# Altium schematic sheet RAK11720.SchDoc
size 420 x 297 mm; ENG_APP_DATE: --/--/--; DSN_APP_DATE: --/--/--; CHK_APP_DATE: --/--/--; Date: TEST; SheetNumber: 1; SheetTotal: 6; Sheet_Text_ProjectName: ApolloEcho_Dev_Kit; Sheet_Text_Author: mtnguyen; Sheet_Text_Title: RAK11720; Sheet_Text_Rev: 2.0.0; Sheet_Text_Date: Mar 01, 25; SPICEModelCacheMDNMBSZG: <root> / <DocumentId>MDNMBSZG</DocumentId> / <CacheFrame Number="0"> / <Model Name="emk105bj105_v-f" Kind="CKT"> / <Text>* EMK105BJ105_V-F     SPICE MODEL  ( General Type ) / *-------------------------------------------------------------------------------------------------------- / * Model Generated by TAIYO YUDEN Corporation (http://www.ty-top.com) / * Version 1.0 / * TAIYO YUDEN Control No. 170508_130520 / * Copyright(c) 2012 TAIYO YUDEN CO.,LTD. All Rights Reserved. / *-------------------------------------------------------------------------------------------------------- / * / * Products Name : Multilayer Ceramic Capacitors / * / * Characteristics : / *     Capacitance : 1 uF , Rated Voltage : 16V , TCC : X5R / *     Case Size : 1.0 x 0.5 / 0.039 x 0.02 [mm/inch] , Thickness : 0.5 / 0.02 [mm/inch] / *     (Conditions: Temperature = 25 degC , DC Bias Current/Voltage = 0A / 0V) / * / * Frequency Range : 40Hz - 3GHz / * / * External Node Assignments : / * / *  1  o---| |---o  2 / * / *-------------------------------------------------------------------------------------------------------- / .SubCkt EMK105BJ105_V-F 1 2 / **************************** / C0 1 110 0.68309u / Cm 1 101 0.26053u / C1 101 102 0.94076u / Rc1 101 102 1.9029k / C2 102 103 0.66707u / Rc2 102 103 120.36 / C3 103 110 0.57203u / Rc3 103 110 2.1097 / C2m 1 301 0.1871u / C21 301 302 3.2494u / Rc21 301 302 1.1117k / C22 302 303 2.1014u / Rc22 302 303 1.484k / C23 303 304 2.1172u / Rc23 303 304 1.3876k / C24 304 305 0.75729u / Rc24 304 305 332.59 / C25 305 306 0.94401u / Rc25 305 306 249.09 / C26 306 307 0.34674u / Rc26 306 307 28.352 / C27 307 308 0.37158u / Rc27 307 308 19.989 / C28 308 309 0.17933u / Rc28 308 309 31.748 / C29 309 110 0.016445u / Rc29 309 110 1.0592 / Rp0 1 110 100Meg / L0 110 120 0.2216n / Lm 120 130 0.1509n / L1 120 121 0.12659n / RL1 121 130 0.85161 / L2 120 122 0.15996n / RL2 122 130 0.42469 / L3 120 123 7.9543n / RL3 123 130 0.54643m / CR 120 124 0.24334u / LR 124 125 0.090738n / RR 125 130 68.076m / CL 130 140 2.7354p / LL 130 140 0.10762n / RL 130 140 50.614 / Rs 140 2 7.5416m / **************************** / .ends EMK105BJ105_V-F</Text> / </Model> / </CacheFrame> / </root>
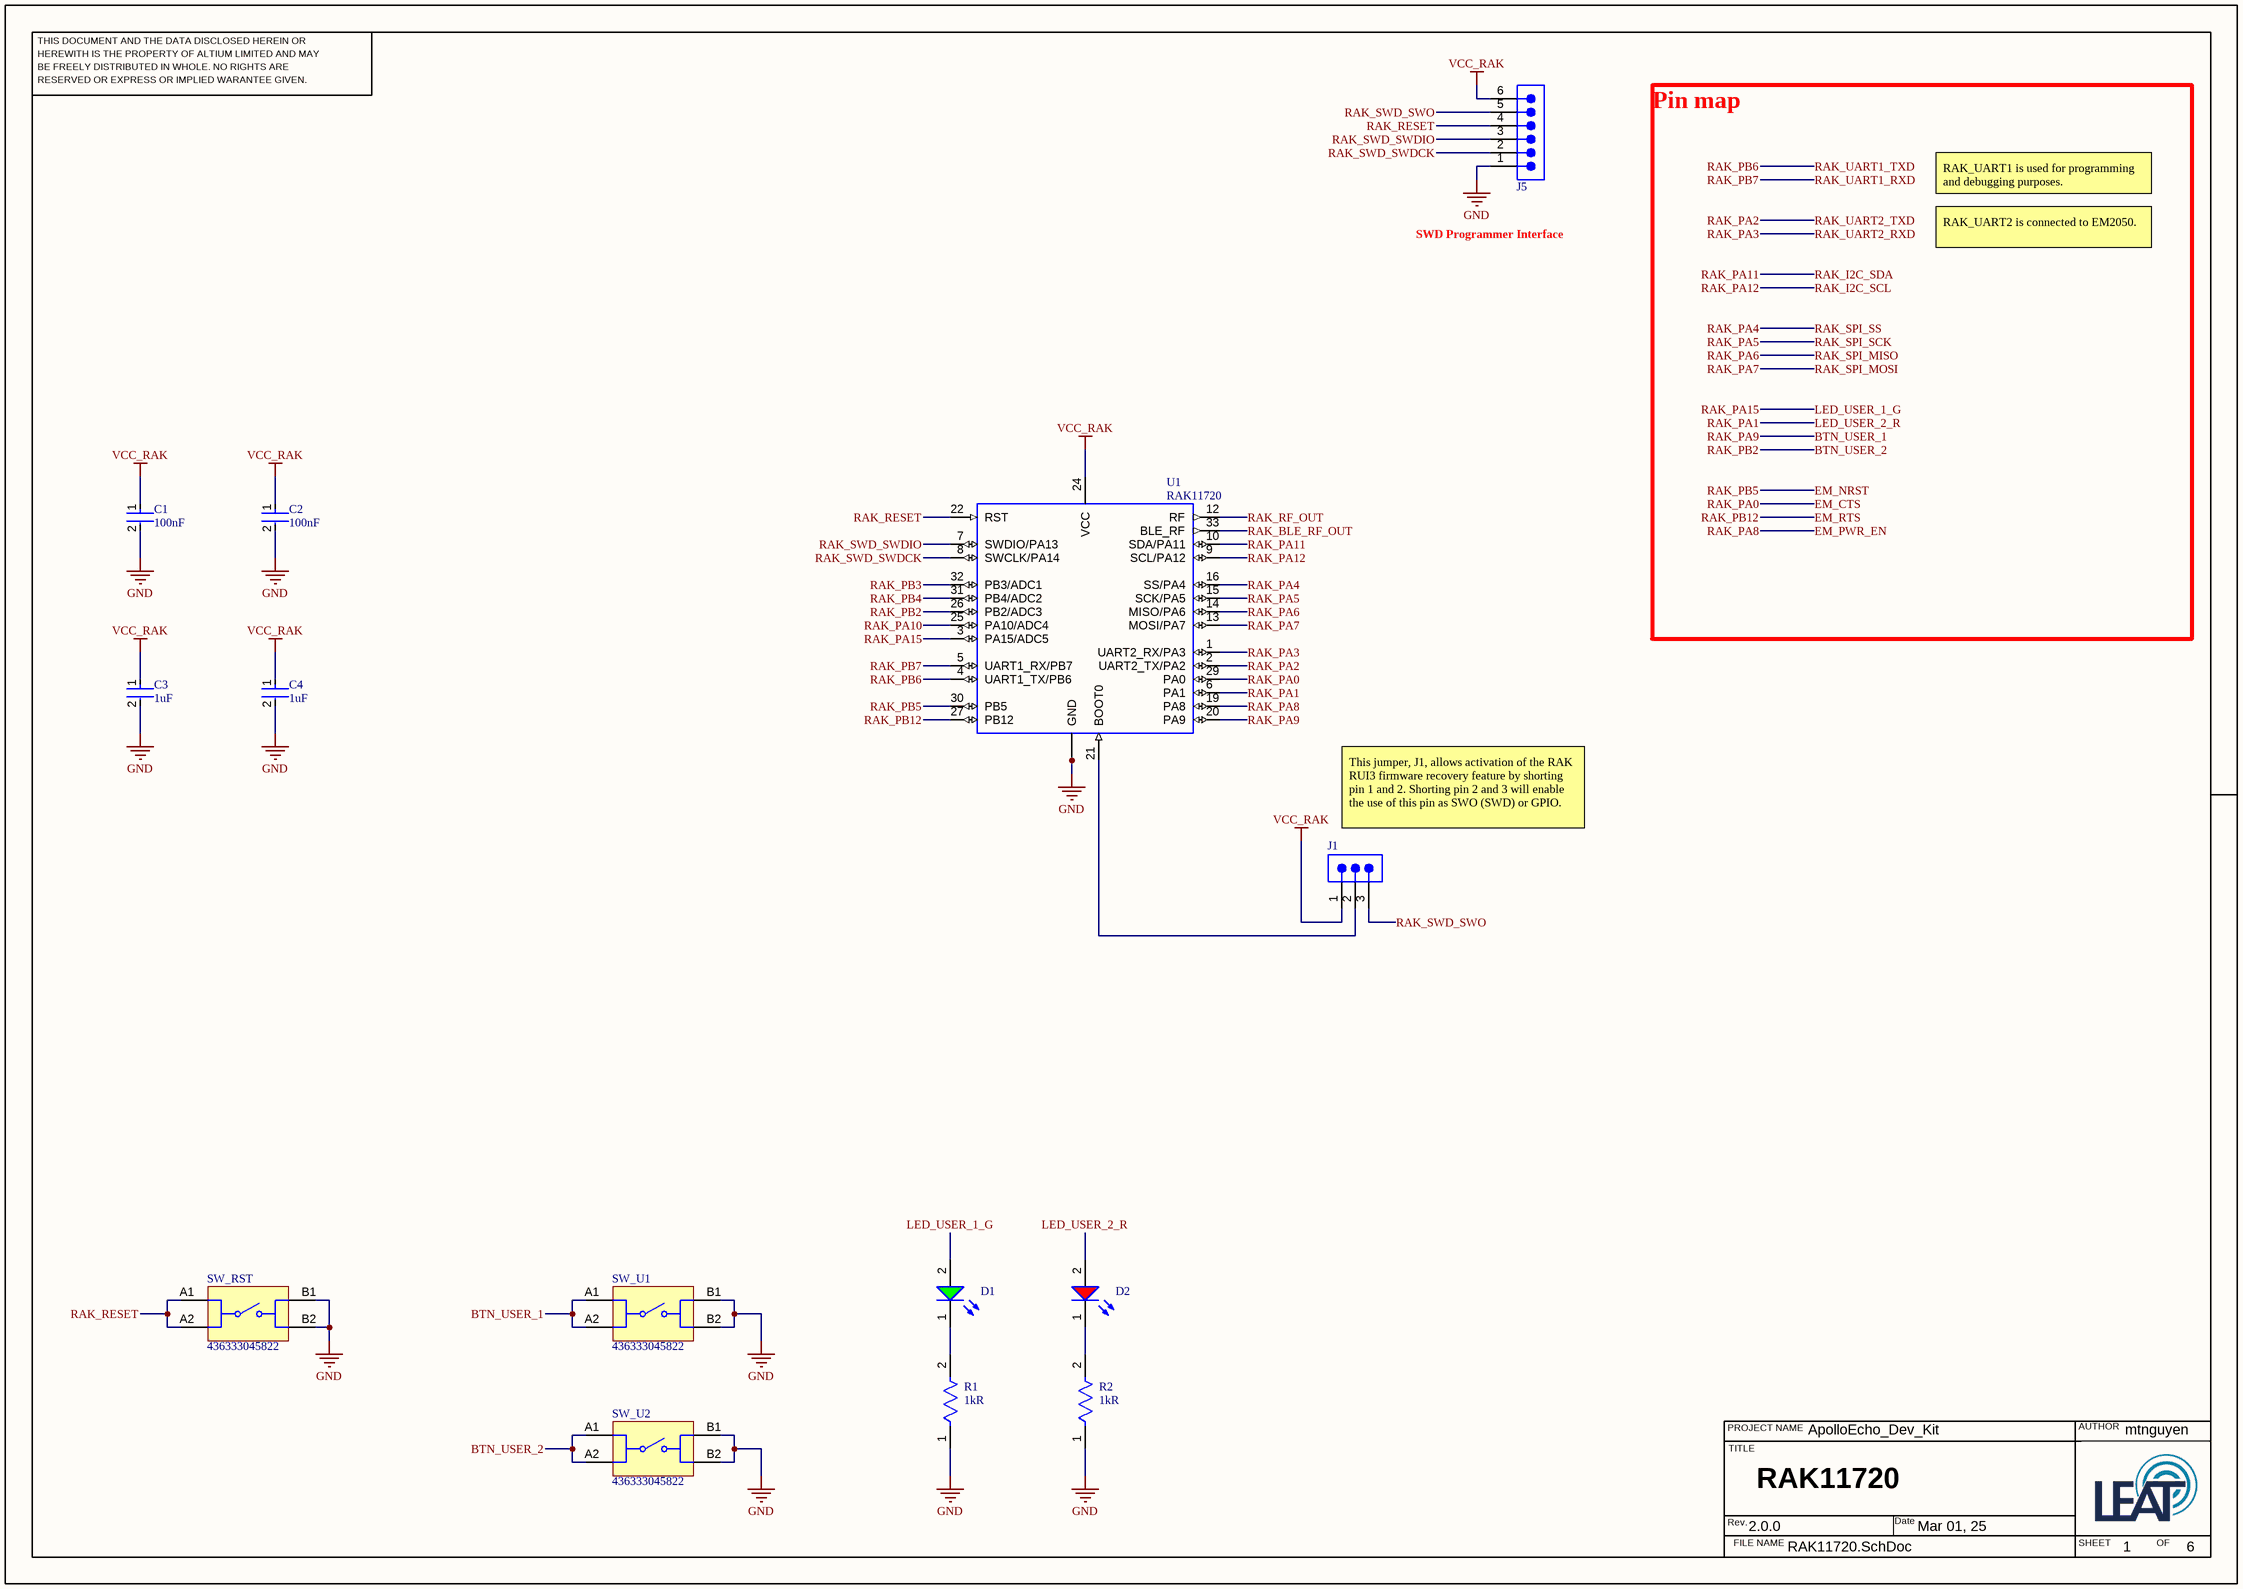
[diagram p0: RAK11720.SchDoc]

## Parts
C1  Capacitance: 100nF  [FP-0402-L_1_0_1-W_0_5_0_1-IPC_C]  (hidden comment: 0402ZD104KAT2A)
C2  Capacitance: 100nF  [FP-0402-L_1_0_1-W_0_5_0_1-IPC_C]  (hidden comment: 0402ZD104KAT2A)
C3  Capacitance: 1uF  [FP-0402-L_1_0_0_05-W_0_5-IPC_A]  (hidden comment: EMK105BJ105KV-F)
C4  Capacitance: 1uF  [FP-0402-L_1_0_0_05-W_0_5-IPC_A]  (hidden comment: EMK105BJ105KV-F)
D1  150060VS75000  [WL-SMCW_0603_150060xx75000]  (value not drawn)
D2  150060RS75000  [WL-SMCW_0603_150060xx75000]  (value not drawn)
J1  61300311121  [61300311121]  (value not drawn)
J5  61300611121  [61300611121]  (value not drawn)
R1  Resistance: 1kR  [FP-RMCF0402-IPC_A]  (hidden comment: RMCF0402FT1K00)
R2  Resistance: 1kR  [FP-RMCF0402-IPC_A]  (hidden comment: RMCF0402FT1K00)
SW_RST  436333045822  [436333045822]
SW_U1  436333045822  [436333045822]
SW_U2  436333045822  [436333045822]
U1  RAK11720  [RAK11720]

## Nets
GND: C1.2 C2.2 C3.2 C4.2 J5.1 R1.1 R2.1 SW_RST.B1 SW_RST.B2 SW_U1.B1 SW_U1.B2 SW_U2.B1 SW_U2.B2 U1.11(GND) U1.17(GND) U1.18(GND) U1.23(GND) U1.28(GND) U1.34(GND)
VCC_RAK: C1.1 C2.1 C3.1 C4.1 J1.1 J5.6 U1.24(VCC)
BTN_USER_1: SW_U1.A1 SW_U1.A2 U1.20(PA9)  [also labelled RAK_PA9]
BTN_USER_2: SW_U2.A1 SW_U2.A2 U1.26(PB2/ADC3)  [also labelled RAK_PB2]
EM_CTS: U1.29(PA0)  [also labelled RAK_PA0]
EM_NRST: U1.30(PB5)  [also labelled RAK_PB5]
EM_PWR_EN: U1.19(PA8)  [also labelled RAK_PA8]
EM_RTS: U1.27(PB12)  [also labelled RAK_PB12]
LED_USER_1_G: D1.2(A) U1.3(PA15/ADC5)  [also labelled RAK_PA15]
LED_USER_2_R: D2.2(A) U1.6(PA1)  [also labelled RAK_PA1]
RAK_BLE_RF_OUT: U1.33(BLE_RF)
RAK_I2C_SCL: U1.9(SCL/PA12)  [also labelled RAK_PA12]
RAK_I2C_SDA: U1.10(SDA/PA11)  [also labelled RAK_PA11]
RAK_PA2: U1.2(UART2_TX/PA2)  [also labelled RAK_UART2_TXD]
RAK_PA3: U1.1(UART2_RX/PA3)  [also labelled RAK_UART2_RXD]
RAK_PA4: U1.16(SS/PA4)  [also labelled RAK_SPI_SS]
RAK_PA5: U1.15(SCK/PA5)  [also labelled RAK_SPI_SCK]
RAK_PA6: U1.14(MISO/PA6)  [also labelled RAK_SPI_MISO]
RAK_PA7: U1.13(MOSI/PA7)  [also labelled RAK_SPI_MOSI]
RAK_PA10: U1.25(PA10/ADC4)
RAK_PB3: U1.32(PB3/ADC1)
RAK_PB4: U1.31(PB4/ADC2)
RAK_PB6: U1.4(UART1_TX/PB6)  [also labelled RAK_UART1_TXD]
RAK_PB7: U1.5(UART1_RX/PB7)  [also labelled RAK_UART1_RXD]
RAK_RESET: J5.4 SW_RST.A1 SW_RST.A2 U1.22(RST)
RAK_RF_OUT: U1.12(RF)
RAK_SWD_SWDCK: J5.2 U1.8(SWCLK/PA14)
RAK_SWD_SWDIO: J5.3 U1.7(SWDIO/PA13)
RAK_SWD_SWO: J1.3 J5.5
NetD1_1: D1.1(K) R1.2
NetD2_1: D2.1(K) R2.2
NetJ1_2: J1.2 U1.21(BOOT0)

## Notes on the sheet
- RAK_UART1 is used for programming and debugging purposes.
- SWD Programmer Interface
- RAK_UART2 is connected to EM2050.
- Pin map
- This jumper, J1, allows activation of the RAK RUI3 firmware recovery feature by shorting pin 1 and 2. Shorting pin 2 and 3 will enable the use of this pin as SWO (SWD) or GPIO.
- THIS DOCUMENT AND THE DATA DISCLOSED HEREIN OR
- HEREWITH IS THE PROPERTY OF ALTIUM LIMITED AND MAY
- BE FREELY DISTRIBUTED IN WHOLE. NO RIGHTS ARE
- RESERVED OR EXPRESS OR IMPLIED WARANTEE GIVEN.
- PROJECT NAME
- TITLE
- AUTHOR
- Rev.
- FILE NAME
- Date
- SHEET
- OF

## Library data of the parts
C1 C2 = CMP-2008-02878-3: General Purpose Ceramic Capacitor, 0402, 100nF, 10%, X5R, 15%, 10V; Dissipation Factor: 5%; Insulation Resistance: 100GR; Case/Package: 0402; Termination: SMD/SMT; Thickness: 0.022inch; Packaging: Tape and Reel; REACH SVHC: No SVHC; Case Code (Imperial): 0402; Width: 0.02inch; Series: -; Construction: Flat; Dielectric: X5R; Voltage: 10V; Height: 0.56mm; Voltage Rating (DC): 10V; Depth: 0.5mm; Tolerance: 10%; Radiation Hardening: No; Voltage Rating: 10V; Package Quantity: 1; Contact Plating: Tin; RoHS Compliant: Yes; Case Code (Metric): 1005; Lead Free: Lead Free; Max Operating Temperature: 85°C; Length: 1mm; Min Operating Temperature: -55°C; Mount: Surface Mount
C3 C4 = CMP-14477-000104-2: None; Tolerance: 10%; Voltage Rating: 16V; Dielectric: X5R; Packaging: Tape and Reel; Depth: 0.5mm; Mount: Surface Mount; Thickness: 0.022inch; Package Quantity: 1; Min Operating Temperature: -55°C; Series: M; Voltage Rating (DC): 16V; Termination: SMD/SMT; Case/Package: 0402; Number of Pins: 2; Case Code (Imperial): 0402; Length: 1mm; Halogen Free: Halogen Free; Case Code (Metric): 1005; Width: 0.02inch; RoHS Compliant: Yes; Radiation Hardening: No; Max Operating Temperature: 85°C; Height: 0.5mm; Construction: Flat
D1 = CMP-1426-00006-7: WURTH ELEKTRONIK - 150060VS75000 - LED, Green, SMD, 0603, 30 mA, 2 V, 570 nm; Reverse Voltage: 5V; Power Dissipation: 72mW; Dominant Wavelength: 570nm; Peak Wavelength: 572nm; Forward Current: 100mA; Forward Voltage: 2V; Lens Style: Clear, Rectangular; Test Current: 20mA; Max Junction Temperature (Tj): 95°C; Viewing Angle: 140°; Luminous Intensity: 40mcd; Height: 700µm; Width: 800µm; Length: 1.6mm; Mount: Surface Mount; Min Operating Temperature: -40°C; Max Reverse Voltage (DC): 5V; Case Code (Imperial): 0603; Wavelength: 570nm; Color: Green; REACH SVHC: Unknown; RoHS: Compliant; Max Operating Temperature: 85°C; Packaging: Tape and Reel; Case/Package: 0603; Number of Pins: 2; Case Code (Metric): 1608
D2 = CMP-1426-00001-4: LED Low-Power Uni-Color Red 630nm 2V 2-Pin Chip 0603(1608Metric) T/R; Max Junction Temperature (Tj): 95°C; Dominant Wavelength: 625nm; Lens Style: Clear, Rectangular; Viewing Angle: 140°; Forward Current: 100mA; Max Reverse Voltage (DC): 5V; Luminous Intensity: 250mcd; Test Current: 20mA; Power Dissipation: 72mW; Max Operating Temperature: 85°C; Mount: Surface Mount; Height: 700µm; Packaging: Tape and Reel; REACH SVHC: Unknown; Case Code (Metric): 1608; Peak Wavelength: 630nm; Forward Voltage: 2V; Case/Package: 0603; Color: Red; RoHS: Compliant; Width: 800µm; Reverse Voltage: 5V; Min Operating Temperature: -40°C; Wavelength: 625nm; Case Code (Imperial): 0603; Length: 1.6mm
J1 = CMP-1502-01062-3: NexarPartId: 32855521; Current Rating: 3A; Voltage Rating: 250V; Number of Positions: 3; Pitch: 2.54mm; Contact Resistance: 20mΩ; Connector Type: Male Pin; Gender: Male; REACH SVHC: Unknown; Packaging: Bulk; Contact Material: Copper; Min Operating Temperature: -40°C; Number of Rows: 1; Orientation: Vertical; RoHS: Compliant; Contact Plating: Gold; Max Operating Temperature: 105°C; Mount: Through Hole; Height: 8.94mm; Operating Supply Voltage: 250V; Number of Pins: 3; Contact Mating Length: 5.9944mm; Number of Contacts: 3; Color: Black; Lead Free: Lead Free; Lead Pitch: 2.54mm; Termination: Solder
J5 = CMP-1502-01070-3: NexarPartId: 20084590; Current Rating: 3A; Pitch: 2.54mm; Gender: Male; Operating Supply Voltage: 250V; Connector Type: Male Pin; Number of Positions: 6; Contact Resistance: 20mΩ; Packaging: Bulk; Number of Pins: 6; Number of Rows: 1; Contact Plating: Gold; Lead Free: Lead Free; RoHS: Compliant; Contact Mating Length: 5.9944mm; Voltage Rating: 250V; REACH SVHC: Unknown; Contact Gender: Male; Housing Material: PBT; Min Operating Temperature: -40°C; Lead Pitch: 2.54mm; Mount: Through Hole; Number of Contacts: 6; Max Operating Temperature: 105°C; Contact Material: Copper; Orientation: Vertical; Termination: Through Hole; Color: Black; Height: 8.89mm
R1 R2 = CMP-26527-000026-1: 1kΩ ±1% 0.063W 0402 Thick Film Chip Resistor AEC-Q200 compliant; Temperature Coefficient: 100ppm/°C; Power Rating: 63mW; Length: 1mm; RoHS Compliant: Yes; Construction: Rectangular; Height: 0.016inch; Size Code: 0402; Lead Free: Lead Free; Radiation Hardening: No; Tolerance: 1%; Width: 0.02inch; Military Standard: Not; Resistor Type: Thick Film; Number of Terminations: 2; Min Operating Temperature: -55°C; Max Operating Temperature: 155°C; Depth: 0.5mm; Features: Automotive AEC-Q200; Packaging: Tape and Reel; Case Code (Metric): 1005; Mount: Surface Mount; Contact Plating: Tin; Max Power Dissipation: 63mW; Case/Package: 0402; Case Code (Imperial): 0402; Series: RMCF
SW_RST SW_U1 SW_U2 = CMP-1464-00001-2: NexarPartId: 22866045; Voltage Rating: 12V; Contact Resistance: 100mΩ; Operating Force: 220N; Current Rating: 50mA; Height: 1.65mm; Contact Plating: Silver; Min Operating Temperature: -40°C; Insulation Resistance: 100MΩ; Max Operating Temperature: 85°C; RoHS: Compliant; Packaging: Tape and Reel; Width: 4.7mm; Contact Current Rating: 50mA
U1 = RAK11720: RAK11720 Ambiq Apollo3 Blue SX1262 LoRa Bluetooth Module for LoRaWAN; MP: RAK3172; MF: Shenzhen RAKwireless Technology Co.,Ltd.; Value: *; Check_prices: https://www.snapeda.com/parts/RAK3172/Shenzhen+RAKwireless+Technology+Co.%252CLtd./view-part/?ref=eda; Package: Package; Price: None; Availability: Not in stock; SnapEDA_Link: https://www.snapeda.com/parts/RAK3172/Shenzhen+RAKwireless+Technology+Co.%252CLtd./view-part/?ref=snap